# EAGLE design stm32f030c8_dev_board (EAGLE 7.6.0)
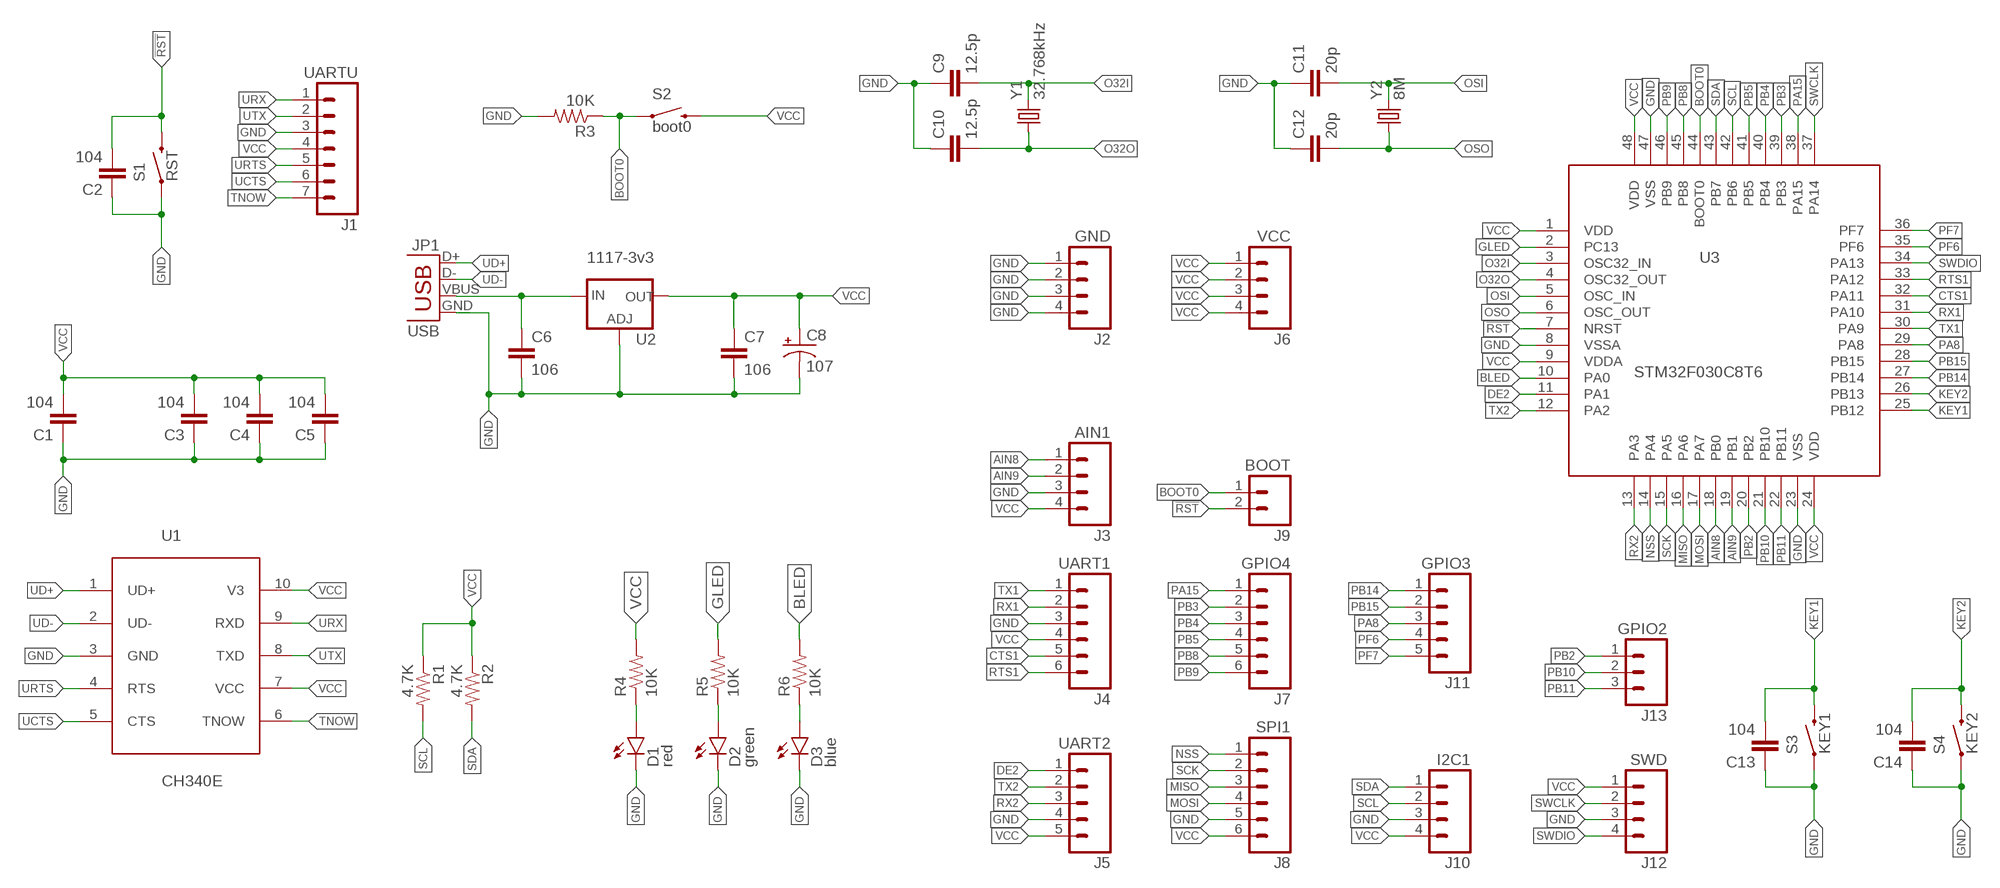
[diagram p0: schematic, sheet 1]

## Parts
C1  104  CAP-SEEED-0402  [C0402]
C2  104  CAP-SEEED-0402  [C0402]
C3  104  CAP-SEEED-0402  [C0402]
C4  104  CAP-SEEED-0402  [C0402]
C5  104  CAP-SEEED-0402  [C0402]
C6  106  CAP0603-CAP  [0603-CAP]
C7  106  CAP0603-CAP  [0603-CAP]
C8  107  CAP_POL3528  [EIA3528]
C9  12.5p  CAP-SEEED-0402  [C0402]
C10  12.5p  CAP-SEEED-0402  [C0402]
C11  20p  CAP-SEEED-0402  [C0402]
C12  20p  CAP-SEEED-0402  [C0402]
C13  104  CAP-SEEED-0402  [C0402]
C14  104  CAP-SEEED-0402  [C0402]
D1  red  LED-SEEED-0603  [LED-0603-SEEED]
D2  green  LED-SEEED-0603  [LED-0603-SEEED]
D3  blue  LED-SEEED-0603  [LED-0603-SEEED]
J1  UARTU  M07NO_SILK  [1X07_NO_SILK]
J2  GND  M041X04_NO_SILK  [1X04_NO_SILK]
J3  AIN1  M041X04_NO_SILK  [1X04_NO_SILK]
J4  UART1  M06NO_SILK_FEMALE_PTH  [1X06_NO_SILK]
J5  UART2  M05NO_SILK  [1X05_NO_SILK]
J6  VCC  M041X04_NO_SILK  [1X04_NO_SILK]
J7  GPIO4  M06NO_SILK_FEMALE_PTH  [1X06_NO_SILK]
J8  SPI1  M06NO_SILK_FEMALE_PTH  [1X06_NO_SILK]
J9  BOOT  M021X02_NO_SILK  [1X02_NO_SILK]
J10  I2C1  M041X04_NO_SILK  [1X04_NO_SILK]
J11  GPIO3  M05NO_SILK  [1X05_NO_SILK]
J12  SWD  M041X04_NO_SILK  [1X04_NO_SILK]
J13  GPIO2  M031X03_NO_SILK  [1X03_NO_SILK]
JP1  USB  [MICROUSB-U-F-M5DD-Y-1]
R1  4.7K  RESISTOR-SEEED-0402  [R0402]
R2  4.7K  RESISTOR-SEEED-0402  [R0402]
R3  10K  RESISTOR-SEEED-0402  [R0402]
R4  10K  RESISTOR-SEEED-0402  [R0402]
R5  10K  RESISTOR-SEEED-0402  [R0402]
R6  10K  RESISTOR-SEEED-0402  [R0402]
S1  RST  SWITCH-MOMENTARY-2PTH  [TACTILE-PTH]
S2  boot0  SWITCH-MOMENTARY-2PTH  [TACTILE-PTH]
S3  KEY1  SWITCH-MOMENTARY-2PTH  [TACTILE-PTH]
S4  KEY2  SWITCH-MOMENTARY-2PTH  [TACTILE-PTH]
U1  CH340E  [MSOP10]
U2  1117-3v3  AMS1117SOT223  [SOT223]
U3  STM32F030C8T6  STM32F030C8T6QFP-48  [QFP50P900X900X160-48N]
Y1  32.768kHz  CRYSTALTC26H  [TC26H]
Y2  8M  CRYSTALHC49US  [HC49US]

## Nets
!RST: C2.2 J9.2 S1.3 U3.7(NRST)
AIN8: J3.1 U3.18(PB0)
AIN9: J3.2 U3.19(PB1)
BLED: R6.2 U3.10(PA0)
BOOT0: J9.1 R3.1 S2.1 U3.44(BOOT0)
CTS1: J4.5 U3.32(PA11)
DE2: J5.1 U3.11(PA1)
GLED: R5.2 U3.2(PC13)
GND: C1.1 C2.1 C3.1 C4.1 C5.1 C6.2 C7.2 C8.C(-) C9.1 C10.1 C11.1 C12.1 C13.1 C14.1 D1.-(C) D2.-(C) D3.-(C) J1.3 J2.1 J2.2 J2.3 J2.4 J3.3 J4.3 J5.4 J8.5 J10.3 J12.3 JP1.GND R3.2 S1.1 S3.1 S4.1 U1.3(GND) U2.1(ADJ) U3.8(VSSA) U3.23(VSS) U3.47(VSS)
KEY1: C13.2 S3.3 U3.25(PB12)
KEY2: C14.2 S4.3 U3.26(PB13)
MISO: J8.3 U3.16(PA6)
MOSI: J8.4 U3.17(PA7)
N$1: D2.+(A) R5.1
N$2: D3.+(A) R6.1
N$7: D1.+(A) R4.1
NSS: J8.1 U3.14(PA4)
O32I: C9.2 U3.3(OSC32_IN) Y1.2
O32O: C10.2 U3.4(OSC32_OUT) Y1.1
OSI: C11.2 U3.5(OSC_IN) Y2.2
OSO: C12.2 U3.6(OSC_OUT) Y2.1
PA8: J11.3 U3.29(PA8)
PA15: J7.1 U3.38(PA15)
PB2: J13.1 U3.20(PB2)
PB3: J7.2 U3.39(PB3)
PB4: J7.3 U3.40(PB4)
PB5: J7.4 U3.41(PB5)
PB8: J7.5 U3.45(PB8)
PB9: J7.6 U3.46(PB9)
PB10: J13.2 U3.21(PB10)
PB11: J13.3 U3.22(PB11)
PB14: J11.1 U3.27(PB14)
PB15: J11.2 U3.28(PB15)
PF6: J11.4 U3.35(PF6)
PF7: J11.5 U3.36(PF7)
RTS1: J4.6 U3.33(PA12)
RX1: J4.2 U3.31(PA10)
RX2: J5.3 U3.13(PA3)
SCK: J8.2 U3.15(PA5)
SCL: J10.2 R1.2 U3.42(PB6)
SDA: J10.1 R2.2 U3.43(PB7)
SWCLK: J12.2 U3.37(PA14)
SWDIO: J12.4 U3.34(PA13)
TNOW: J1.7 U1.6(TNOW)
TX1: J4.1 U3.30(PA9)
TX2: J5.2 U3.12(PA2)
UCTS: J1.6 U1.5(CTS)
UD+: JP1.D+ U1.1(UD+)
UD-: JP1.D- U1.2(UD-)
URTS: J1.5 U1.4(RTS)
URX: J1.1 U1.9(RXD)
UTX: J1.2 U1.8(TXD)
VBUS: C6.1 JP1.VBUS U2.3(IN)
VCC: C1.2 C3.2 C4.2 C5.2 C7.1 C8.A(+) J1.4 J3.4 J4.4 J5.5 J6.1 J6.2 J6.3 J6.4 J8.6 J10.4 J12.1 R1.1 R2.1 R4.2 S2.3 U1.7(VCC) U1.10(V3) U2.2(OUT) U2.4(OUT) U3.1(VDD) U3.9(VDDA) U3.24(VDD) U3.48(VDD)

## Library data of the parts
C1-C7 C9-C14 = z_jlc_smt:CAP: Capacitor Standard 0603 ceramic capacitor, and 0.1" leaded capacitor.
C8 = z_jlc_smt:CAP_POL: Capacitor Polarized These are standard SMD and PTH capacitors. Normally 10uF, 47uF, and 100uF in electrolytic and tantalum varieties. Always verify the external diameter of the through hole cap, it varies with capacity, voltage, and manufacturer. The EIA devices should be standard.
D1-D3 = z_jlc_smt:LED: LEDs Standard schematic elements and footprints for 5mm, 3mm, 1206, and 0603 sized LEDs. 5mm - Spark Fun Electronics SKU : COM-00529 (and others)
J1 = SparkFun-Connectors:M07: Header 7 Standard 7-pin 0.1" header. Use with straight break away headers (SKU : PRT-00116), right angle break away headers (PRT-00553), swiss pins (PRT-00743), machine pins (PRT-00117), and female headers (PRT-00115). NOTES ON THE VARIANTS LOCK and LOCK_LONGPADS... This footprint was designed to help hold the alignment of a through-hole component (i.e. 7-pin header) while soldering it into place. You may notice that each hole has been shifted either up or down by 0.005 of an inch from it's more standard position (which is usually a perfectly straight line). This slight alteration caused the pins (the squares in the middle) to touch the edges of the holes. Because they are alternating, it causes a "brace" to hold the header in place. 0.005 has proven to be the perfect amount of "off-center" position when using our standard breakaway headers. Although looks a little odd when you look at the bare footprint, once you have a header in there, the alteration is very hard to notice. Also, if you push a header all the way into place, it is covered up entirely on the bottom side. This idea of altering the position of holes to aid alignment will be further integrated into the Sparkfun Library for other footprints. It can help hold any component with 3 or more connection pins.
J2 J3 J6 J10 J12 = SparkFun-Connectors:M04: Header 4 Standard 4-pin 0.1" header. Use with straight break away headers (SKU : PRT-00116), right angle break away headers (PRT-00553), swiss pins (PRT-00743), machine pins (PRT-00117), and female headers (PRT-00115). Molex polarized connector foot print use with SKU : PRT-08231 with associated crimp pins and housings. 1MM SMD Version SKU: PRT-10208; PROD_ID: CONN-09696
J4 J7 J8 = SparkFun-Connectors:M06: Header 6 Standard 6-pin 0.1" header. Use with straight break away headers (SKU : PRT-00116), right angle break away headers (PRT-00553), swiss pins (PRT-00743), machine pins (PRT-00117), and female headers (PRT-00115). Molex polarized connector foot print use with SKU : PRT-08094 with associated crimp pins and housings. NOTES ON THE VARIANTS LOCK and LOCK_LONGPADS... This footprint was designed to help hold the alignment of a through-hole component (i.e. 6-pin header) while soldering it into place. You may notice that each hole has been shifted either up or down by 0.005 of an inch from it's more standard position (which is a perfectly straight line). This slight alteration caused the pins (the squares in the middle) to touch the edges of the holes. Because they are alternating, it causes a "brace" to hold the component in place. 0.005 has proven to be the perfect amount of "off-center" position when using our standard breakaway headers. Although looks a little odd when you look at the bare footprint, once you have a header in there, the alteration is very hard to notice. Also,if you push a header all the way into place, it is covered up entirely on the bottom side. This idea of altering the position of holes to aid alignment will be further integrated into the Sparkfun Library for other footprints. It can help hold any component with 3 or more connection pins.; PROD_ID: CONN-08437
J5 J11 = SparkFun-Connectors:M05: Header 5 Standard 5-pin 0.1" header. Use with straight break away headers (SKU : PRT-00116), right angle break away headers (PRT-00553), swiss pins (PRT-00743), machine pins (PRT-00117), and female headers (PRT-00115). Molex polarized connector foot print use with SKU : PRT-08230 with associated crimp pins and housings.
J9 = SparkFun-Connectors:M02: Standard 2-pin 0.1" header. Use with - straight break away headers ( PRT-00116) - right angle break away headers (PRT-00553) - swiss pins (PRT-00743) - machine pins (PRT-00117) - female headers (PRT-00115) Molex polarized connector foot print use with: PRT-08233 with associated crimp pins and housings. 2.54_SCREWTERM for use with PRT-10571. 3.5mm Screw Terminal footprints for PRT-08084 5mm Screw Terminal footprints for use with PRT-08432
J13 = SparkFun-Connectors:M03: Header 3 Standard 3-pin 0.1" header. Use with straight break away headers (SKU : PRT-00116), right angle break away headers (PRT-00553), swiss pins (PRT-00743), machine pins (PRT-00117), and female headers (PRT-00115). Molex polarized connector foot print use with SKU : PRT-08232 with associated crimp pins and housings.
JP1 = xmgu2008:USB: USB Connectors USB-B-PTH is fully proven SKU : PRT-00139/CONN-08278 USB-miniB is fully proven SKU : PRT-00587 USB-A-PCB is untested. USB-A-H is throughly reviewed, but untested. Spark Fun Electronics SKU : PRT-00437 USB-B-SMT is throughly reviewed, but untested. Needs silkscreen touching up. USB-A-S has not been used/tested USB-MB-H has not been used/tested USB-MICROB has been used. CONN-09505
R1-R6 = z_jlc_smt:RESISTOR: Resistor Basic schematic elements and footprints for 0603, 1206, and PTH resistors.
S1-S4 = SparkFun-Electromechanical:SWITCH-MOMENTARY-2: Various NO switches- pushbuttons, reed, etc; PROD_ID: SWCH-08441
U1 = xmgu2008:CH340E
U2 = z_jlc_smt:AMS1117: Voltage Regulator AMS1117; PROD_ID: VREG-08170
U3 = z_jlc_smt:STM32F030C8T6
Y1 = xmgu2008:CRYSTAL: Various standard crystals. Proven footprints.; PROD_ID: XTAL-10112
Y2 = xmgu2008:CRYSTAL: Various standard crystals. Proven footprints.

## Board
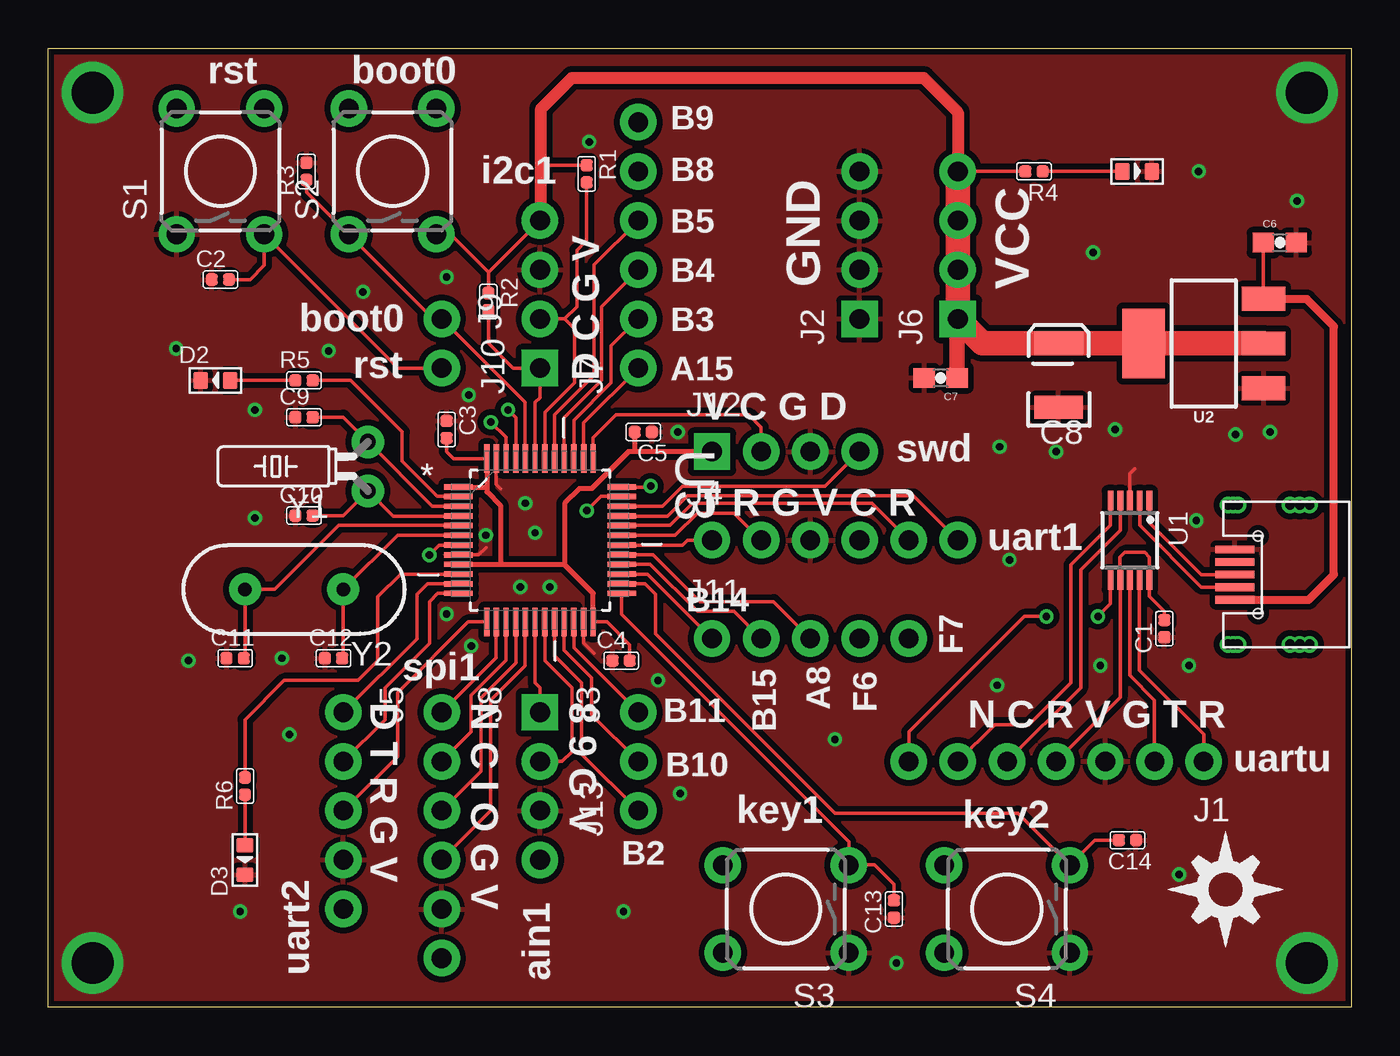
[diagram p1: board, top side]
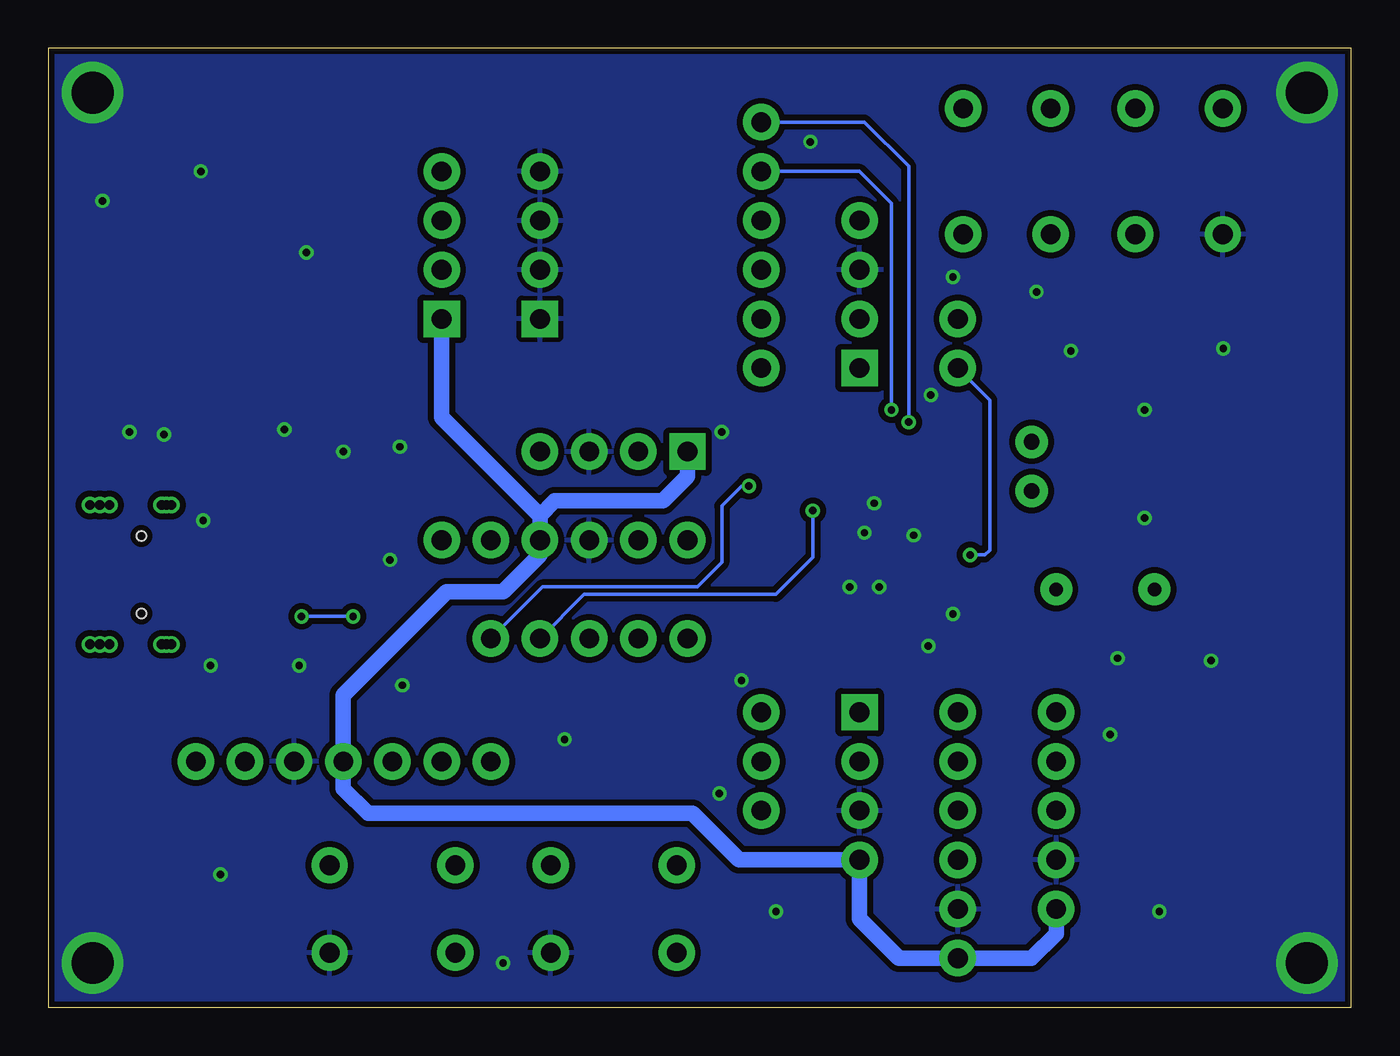
[diagram p2: board, bottom side, seen from below]

Size 67.31 x 49.53 mm. Coordinates in mm from the lower left corner, seen from the top.
Outline: 0,0 0,49.53 67.31,49.53 67.31,0 0,0
Copper layers (1*16): Top 0.035mm / dielectric 1.5mm / Bottom 0.035mm
Design rules "SparkFun-2-layer-TIGHT": minimum track width 7mil, minimum drill 15mil, track to track 7mil, track to pad 7mil, pad to pad 7mil, via to via 7mil, smd to smd 7mil, copper to edge 7mil, drill to drill 7mil, minimum pad ring 7mil, minimum via ring 7mil, stop-mask expansion 4mil, vias tented up to drill 20mil, thermal gap 10mil

### Footprints (pad centres in the part's own frame; a part is rotated, then mirrored left to right if it is on the bottom)
C0402 = smd 0.635 x 0.635: 1 -0.445,0; 2 0.445,0
0603-CAP = smd 1.1 x 1: 1 -0.85,0; 2 0.85,0
EIA3528 = smd 1.2 x 2.5: A 1.65,0; C -1.65,0
LED-0603-SEEED = smd 0.762 x 0.889: + 0.762,0; - -0.762,0
1X07_NO_SILK = drill 1.016 pad 1.88: 1 0,0; 2 2.54,0; 3 5.08,0; 4 7.62,0; 5 10.16,0; 6 12.7,0; 7 15.24,0
1X04_NO_SILK = drill 1.016 pad 1.88 square: 1 0,0 | drill 1.016 pad 1.88: 2 2.54,0; 3 5.08,0; 4 7.62,0
1X06_NO_SILK = drill 1.016 pad 1.88: 1 0,0; 2 2.54,0; 3 5.08,0; 4 7.62,0; 5 10.16,0; 6 12.7,0
1X05_NO_SILK = drill 1.016 pad 1.88: 1 0,0; 2 2.54,0; 3 5.08,0; 4 7.62,0; 5 10.16,0
1X02_NO_SILK = drill 1.016 pad 1.88: 1 0,0; 2 2.54,0
1X03_NO_SILK = drill 1.016 pad 1.88: 1 0,0; 2 2.54,0; 3 5.08,0
MICROUSB-U-F-M5DD-Y-1 = drill 0.5: 6_1 3.6,0.25; 6_2 3.6,0.5; 6_3 3.6,0.75; 7_1 3.6,3.45; 7_2 3.6,3.95; 7_3 3.6,4.45; 8_1 -3.6,4.45; 8_2 -3.6,3.95; 8_3 -3.6,3.45; 9_1 -3.6,0.75; 9_2 -3.6,0.5; 9_3 -3.6,0.25 | smd 0.4 x 2: D+ 0,0.6; D- 0.65,0.6; GND -1.3,0.6; ID -0.65,0.6; VBUS 1.3,0.6 | hole 0.5: -2,1.8; 2,1.8
R0402 = smd 0.635 x 0.635: 1 -0.445,0; 2 0.445,0
TACTILE-PTH = drill 1.016 pad 1.88: 1 -3.251,2.261; 2 3.251,2.261; 3 -3.251,-2.261; 4 3.251,-2.261
MSOP10 = smd 0.3 x 1: 1 -1,-2.05; 2 -0.5,-2.05; 3 0,-2.05; 4 0.5,-2.05; 5 1,-2.05; 6 1,2.05; 7 0.5,2.05; 8 0,2.05; 9 -0.5,2.05; 10 -1,2.05
SOT223 = smd 2.235 x 1.219: 1 3.099,-2.311; 2 3.099,0; 3 3.099,2.311 | smd 2.2 x 3.6: 4 -3.099,0
QFP50P900X900X160-48N = smd 0.279 x 1.473: 1 -2.743,-4.216; 2 -2.261,-4.216; 3 -1.753,-4.216; 4 -1.245,-4.216; 5 -0.762,-4.216; 6 -0.254,-4.216; 7 0.254,-4.216; 8 0.762,-4.216; 9 1.245,-4.216; 10 1.753,-4.216; 11 2.261,-4.216; 12 2.743,-4.216; 25 2.743,4.216; 26 2.261,4.216; 27 1.753,4.216; 28 1.245,4.216; 29 0.762,4.216; 30 0.254,4.216; 31 -0.254,4.216; 32 -0.762,4.216; 33 -1.245,4.216; 34 -1.753,4.216; 35 -2.261,4.216; 36 -2.743,4.216 | smd 1.473 x 0.279: 13 4.216,-2.743; 14 4.216,-2.261; 15 4.216,-1.753; 16 4.216,-1.245; 17 4.216,-0.762; 18 4.216,-0.254; 19 4.216,0.254; 20 4.216,0.762; 21 4.216,1.245; 22 4.216,1.753; 23 4.216,2.261; 24 4.216,2.743; 37 -4.216,2.743; 38 -4.216,2.261; 39 -4.216,1.753; 40 -4.216,1.245; 41 -4.216,0.762; 42 -4.216,0.254; 43 -4.216,-0.254; 44 -4.216,-0.762; 45 -4.216,-1.245; 46 -4.216,-1.753; 47 -4.216,-2.261; 48 -4.216,-2.743
TC26H = drill 0.813 pad 1.676: 1 -1.27,0; 2 1.27,0
HC49US = drill 0.7 pad 1.651: 1 -2.54,0; 2 2.54,0

### Placement (x,y rotation side)
C1  57.66,19.56 90 top
C2  8.89,37.59 0 top
C3  20.57,29.84 270 top
C4  29.59,17.91 0 top
C5  30.73,29.72 180 top
C6  63.63,39.5 0 top
C7  46.1,32.51 180 top
C8  52.2,32.64 90 top
C9  13.21,30.48 0 top
C10  13.21,25.4 0 top
C11  9.65,18.03 0 top
C12  14.73,18.03 0 top
C13  43.69,5.08 90 top
C14  55.75,8.64 180 top
D1  56.26,43.18 180 top
D2  8.64,32.38 0 top
D3  10.16,7.62 90 top
J1  59.69,12.7 180 top
J2  41.91,35.56 90 top
J3  25.4,15.24 270 top
J4  34.29,24.13 0 top
J5  15.24,15.24 270 top
J6  46.99,35.56 90 top
J7  30.48,33.02 90 top
J8  20.32,15.24 270 top
J9  20.32,35.56 270 top
J10  25.4,33.02 90 top
J11  34.29,19.05 0 top
J12  34.29,28.7 0 top
J13  30.48,10.16 90 top
JP1  60.71,22.35 270 top
R1  27.81,43.05 270 top
R2  22.73,36.45 270 top
R3  13.34,43.18 90 top
R4  50.93,43.18 180 top
R5  13.21,32.38 0 top
R6  10.16,11.43 90 top
S1  8.89,43.18 90 top
S2  17.78,43.18 90 top
S3  38.1,5.08 180 top
S4  49.53,5.08 180 top
U1  55.88,24.13 180 top
U2  59.69,34.29 0 top
U3  25.4,24.13 270 top
U$1  [DIYNOVA_LOGO]  57.78,3.05 0 top
Y1  16.51,27.94 90 top
Y2  12.7,21.59 180 top

### Tracks (layer width: path | path; a pad name or v marks a point on that pad's centre or on a via)
!RST  (via drill 0.38)
  Top 0.178: U3.7 20.19,23.88 v19.68,23.37 | J9.2 18.06,33.02 S1.3 11.15,38.33 10.41,37.59 C2.2
  Bottom 0.178: v19.68,23.37 18.92,23.37 18.67,23.62 18.67,31.37 J9.2
AIN8
  Top 0.178: U3.18 25.15,16.76 25.4,16.51 J3.1
AIN9
  Top 0.178: U3.19 25.65,17.91 27.05,16.51 27.05,13.21 26.54,12.7 J3.2
BLED
  Top 0.178: U3.10 18.19,22.38 17.02,21.21 17.02,17.91 16,16.89 12.19,16.89 10.16,14.86 R6.2
BOOT0
  Top 0.178: U3.44 24.64,31.24 J9.1 19.89,35.56 S2.1 13.34,42.11 R3.1
CTS1
  Top 0.178: U3.32 32.13,24.89 33.27,26.04 42.55,26.04 J4.5
DE2
  Top 0.178: U3.11 19.58,21.87 19.05,21.34 19.05,19.05 J5.1
GLED
  Top 0.178: U3.2 20.09,26.39 18.29,28.19 18.29,29.72 15.62,32.38 R5.2
GND  (via drill 0.38, 2.16)
  Top 0.178: U1.3 55.88,27.56 56.13,27.81 | U3.47 23.14,27.03 23.37,26.8 | U3.23 27.66,18.82 28.19,18.29 | U3.8 22.23,23.37 22.61,23.75
  other vias: 54.36,17.65 32.51,29.72 24.64,26.04 31.5,16.89 21.84,18.67 20.57,20.32 12.06,18.03 10.67,25.27 22.61,24.38 21.72,31.62 24.38,21.72 32.64,11.05 49.66,23.11 52.07,28.7 55.12,29.84 49.15,28.96 63.12,29.72 61.34,29.59 59.31,25.15 64.52,41.66 59.44,43.18 53.98,38.99 27.94,44.7 6.6,34.04 10.67,30.86 7.24,17.91 9.91,4.95 29.72,4.95 43.81,2.29 58.42,6.86 2.29,47.24 2.29,2.29 65.02,2.29 65.02,47.24 25.15,24.51 25.91,21.72 40.64,13.84 49.02,16.64 58.93,17.65 12.45,14.1 14.48,33.91 16.26,36.96 20.57,37.72
  pour Top (isolate 0.305): 0,0 0,49.53 67.31,49.53 67.31,0
  pour Bottom (isolate 0.305): 0,0 0,49.53 67.31,49.53 67.31,0
KEY1
  Top 0.178: U3.25 29.62,20.3 41.35,8.56 S3.3 41.38,7.37 42.67,7.37 43.69,6.35 C13.2
KEY2
  Top 0.178: U3.26 30.84,21.87 31.37,21.34 31.37,19.3 40.64,10.03 50.09,10.03 S4.3 54.08,8.64 C14.2
MISO
  Top 0.178: U3.16 24.16,17.8 22.35,16 22.35,12.19 J8.3
MOSI
  Top 0.178: U3.17 24.64,17.65 22.86,15.88 22.86,10.16 J8.4
N$1
  Top 0.178: D2.+ R5.1
N$2
  Top 0.178: R6.1 D3.+
N$7
  Top 0.178: D1.+ R4.1
NSS
  Top 0.178: U3.14 23.14,18.06 J8.1
O32I
  Top 0.178: U3.3 19.84,25.88 Y1.2 15.24,30.48 C9.2
O32O
  Top 0.178: U3.4 17.8,25.38 Y1.1 15.24,25.4 C10.2
OSI
  Top 0.178: U3.5 14.99,24.89 11.68,21.59 Y2.2 10.16,18.1 C11.2
OSO
  Top 0.178: U3.6 18.03,24.38 Y2.1 15.24,18.1 C12.2
PA8
  Top 0.178: U3.29 31.24,23.37 33.66,20.95 37.47,20.95 J11.3
PA15
  Top 0.178: U3.38 27.66,30.2 J7.1
PB2
  Top 0.178: U3.20 26.16,18.16 27.56,16.76 27.56,13.08 J13.1
PB3
  Top 0.178: U3.39 27.15,30.33 29.08,32.26 29.08,34.16 J7.2
PB4
  Top 0.178: U3.40 26.64,30.45 28.57,32.38 28.57,36.2 J7.3
PB5
  Top 0.178: U3.41 26.16,30.61 28.19,32.64 28.19,38.35 J7.4
PB8  (via drill 0.38)
  Top 0.178: U3.45 24.16,30.45 v23.75,30.86
  Bottom 0.178: v23.75,30.86 23.75,41.53 25.4,43.18 J7.5
PB9  (via drill 0.38)
  Top 0.178: U3.46 23.65,29.44 v22.86,30.23
  Bottom 0.178: v22.86,30.23 22.86,43.43 25.15,45.72 J7.6
PB10
  Top 0.178: U3.21 26.64,18.44 28.07,17.02 28.07,15.11 J13.2
PB11
  Top 0.178: U3.22 27.15,18.57 J13.3
PB14
  Top 0.178: U3.27 30.96,22.38 J11.1
PB15
  Top 0.178: U3.28 31.09,22.89 33.53,20.45 35.43,20.45 J11.2
PF6  (via drill 0.38)
  Top 0.178: U3.35 28.55,26.39 v27.81,25.65
  Bottom 0.178: J11.4 39.62,21.34 29.72,21.34 27.81,23.24 v27.81,25.65
PF7  (via drill 0.38)
  Top 0.178: U3.36 31.06,26.87 v31.11,26.92
  Bottom 0.178: v31.11,26.92 31.5,26.92 32.51,25.91 32.51,22.99 33.78,21.72 41.78,21.72 J11.5
RTS1
  Top 0.178: U3.33 31.98,25.38 33.02,26.42 44.7,26.42 J4.6
RX1
  Top 0.178: U3.31 32.38,24.38 33.53,25.53 35.43,25.53 J4.2
RX2
  Top 0.178: U3.13 21.69,19.91 18.03,16.26 18.03,12.95 J5.3
SCK
  Top 0.178: U3.15 23.65,17.93 21.84,16.13 21.84,14.22 J8.2
SCL
  Top 0.178: U3.42 25.65,30.73 27.18,32.26 27.18,35.05 26.67,35.56 | 26.67,35.56 J10.2 | R1.2 27.81,39.62 27.3,39.12 27.3,36.2 26.67,35.56
SDA
  Top 0.178: U3.43 25.15,31.24 25.4,31.5 J10.1 24,33.02 22.73,34.29 R2.2
SWCLK
  Top 0.178: J12.2 36.83,29.97 36.2,30.61 29.34,30.61 28.14,29.41 U3.37
SWDIO
  Top 0.178: U3.34 31.73,25.88 32.77,26.92 40.13,26.92 J12.4
TNOW  (via drill 0.38)
  Top 0.178: U1.6 54.88,20.84 v54.23,20.19 | v51.56,20.19 50.42,20.19 44.45,14.22 J1.7
  Bottom 0.178: v54.23,20.19 v51.56,20.19
TX1
  Top 0.178: U3.30 32.77,23.88 33.02,24.13 J4.1
TX2
  Top 0.178: U3.12 20.12,21.39 19.68,20.95 19.68,18.8 17.4,16.51 17.4,14.86 J5.2
UCTS
  Top 0.178: U1.5 54.88,24.91 52.83,22.86 52.83,16.76 50.67,14.61 48.9,14.61 J1.6
UD+
  Top 0.178: JP1.D+ 59.56,22.35 56.9,25.02 56.9,26.16 U1.1
UD-
  Top 0.178: JP1.D- 59.58,21.7 56.39,24.89 U1.2
URTS
  Top 0.178: U1.4 55.38,24.65 53.34,22.61 53.34,16.51 J1.5
URX
  Top 0.178: U1.9 56.38,17.41 59.69,14.1 J1.1
UTX
  Top 0.178: U1.8 55.88,17.14 57.15,15.88 J1.2
VBUS
  Top 0.178: C6.1 62.78,36.61 U2.3
  Top 0.406: JP1.VBUS 65.12,21.05 66.42,22.35 66.42,35.18 65.02,36.58 62.81,36.58 U2.3
VCC
  Top 0.178: J1.4 55.38,16.01 U1.7 55.37,23.24 55.63,23.5 56.64,23.5 56.88,23.26 U1.10 56.88,21.23 57.66,20.45 C1.2 | R2.1 22.73,37.97 | 22.73,37.97 J10.4 25.46,40.7 | S2.3 20.78,39.93 22.73,37.97 | R4.2 J6.4 | U3.24 28.85,19.91 30.04,18.73 C4.2 | U3.48 20.93,28.35 20.57,28.7 C3.2 | R1.1 25.53,43.5 25.46,43.56
  Top 0.254: U3.9 23.37,22.89 | 23.37,22.89 26.64,22.89 | 26.64,22.89 28.14,21.39 U3.24 | U3.48 22.66,26.8 | 22.66,26.8 22.66,26.62 23.37,25.91 23.37,22.89 | U3.1 22.58,26.87 22.66,26.8 | J12.1 30.23,28.7 | 30.23,28.7 29.97,28.7 28.07,26.8 27.43,26.8 26.67,26.04 26.67,22.91 26.64,22.89 | C5.2 30.29,28.77 30.23,28.7
  Top 0.61: 25.46,40.7 25.46,43.56 25.46,46.42 27.05,48.01 45.21,48.01 46.99,46.23 J6.4
  Top 0.813: C7.1 46.95,35.52 J6.1
  Top 1.27: U2.2 U2.4 C8.A 48.26,34.29 J6.1 J6.2 J6.3 J6.4
  Bottom 0.813: 41.91,25.4 J4.4 41.91,23.37 43.81,21.46 46.74,21.46 52.07,16.13 J1.4 52.07,11.3 50.8,10.03 34.04,10.03 31.62,7.62 J3.4 25.4,4.57 23.37,2.54 J8.6 16.51,2.54 15.24,3.81 J5.5 | 41.91,25.4 46.99,30.48 J6.1 | 41.91,25.4 41.15,26.16 35.56,26.16 34.29,27.43 J12.1

### Text on the board
tPlace: rst | boot0 | B9 | i2c1 | B8 | B5 | B4 | GND | VCC | boot0 | B3 | rst | D C G V | A15 | V C G D | swd | T R G V C R | uart1 | B14 | F7 | spi1 | D T R G V | N C I O G V | 8 9 G V | N C R V G T R | B11 | A8 | F6 | B15 | B10 | uartu | key1 | key2 | B2 | uart2 | ain1